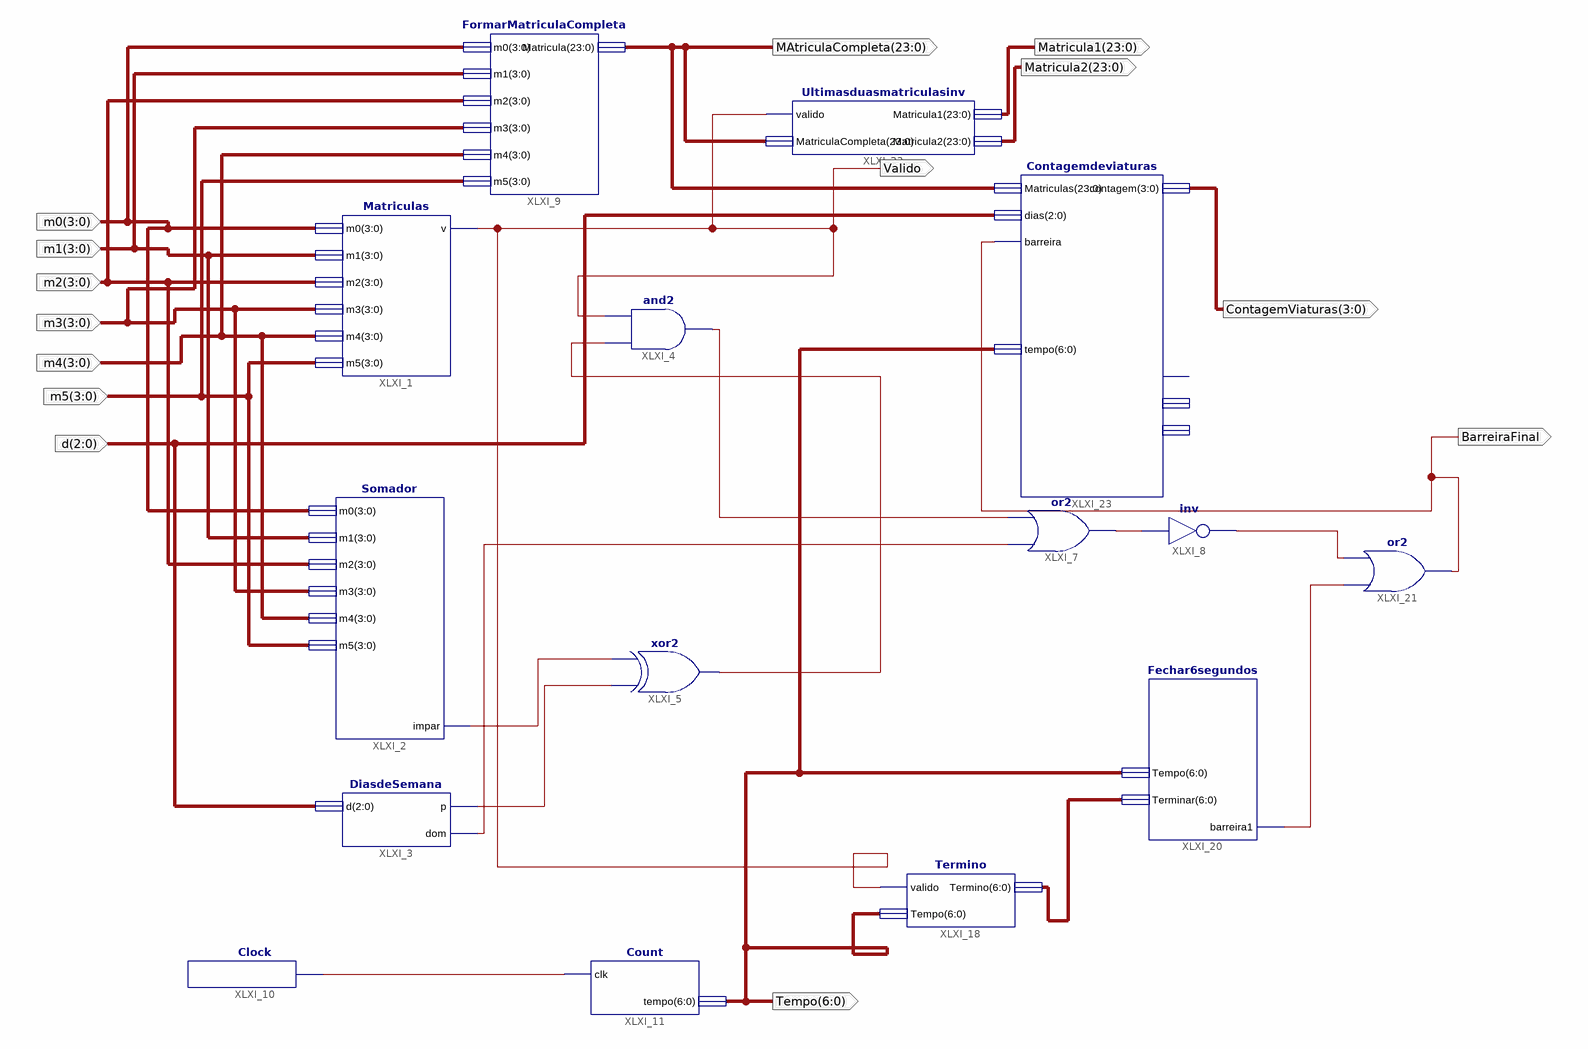
[diagram p0: schematic sheet 1]
// Xilinx ISE schematic Resultado.sch (spartan6) as structural Verilog: 15 symbols, 14 ports
module Resultado (
  input  [3:0] m0,
  input  [3:0] m1,
  input  [3:0] m2,
  input  [3:0] m3,
  input  [3:0] m4,
  input  [3:0] m5,
  input  [2:0] d,
  output [23:0] MAtriculaCompleta,
  output [6:0] Tempo,
  output Valido,
  output [23:0] Matricula1,
  output [23:0] Matricula2,
  output [3:0] ContagemViaturas,
  output BarreiraFinal
);

  wire Barreira1, Barreirafechada, clk, XLXN_18, XLXN_21, XLXN_24, XLXN_25, XLXN_29, XLXN_30;
  wire [6:0] termino;

  Matriculas XLXI_1 (.m0(m0), .m1(m1), .m2(m2), .m3(m3), .m4(m4), .m5(m5), .v(Valido));
  Somador XLXI_2 (.m0(m0), .m1(m1), .m2(m2), .m3(m3), .m4(m4), .m5(m5), .impar(XLXN_29));
  DiasdeSemana XLXI_3 (.d(d), .p(XLXN_21), .dom(XLXN_24));
  and XLXI_4 (XLXN_25, XLXN_18, Valido);
  xor XLXI_5 (XLXN_18, XLXN_21, XLXN_29);
  FormarMatriculaCompleta XLXI_9 (.m0(m0), .m1(m1), .m2(m2), .m3(m3), .m4(m4), .m5(m5), .Matricula(MAtriculaCompleta));
  Clock XLXI_10 (.clk(clk));
  Count XLXI_11 (.clk(clk), .tempo(Tempo));
  Termino XLXI_18 (.valido(Valido), .Tempo(Tempo), .Termino(termino));
  Fechar6segundos XLXI_20 (.Terminar(termino), .Tempo(Tempo), .barreira1(Barreira1));
  or XLXI_21 (BarreiraFinal, Barreira1, Barreirafechada);
  Ultimasduasmatriculasinv XLXI_22 (
    .valido(Valido), .MatriculaCompleta(MAtriculaCompleta), .Matricula1(Matricula1), .Matricula2(Matricula2));
  or XLXI_7 (XLXN_30, XLXN_24, XLXN_25);
  not XLXI_8 (Barreirafechada, XLXN_30);
  Contagemdeviaturas XLXI_23 (
    .barreira(BarreiraFinal), .Matriculas(MAtriculaCompleta), .tempo(Tempo), .dias(d),
    .contagem(ContagemViaturas));  // open: semana, diainicial, matriculaanterior
endmodule
